# Altium project 0x2a002a.PrjPcb
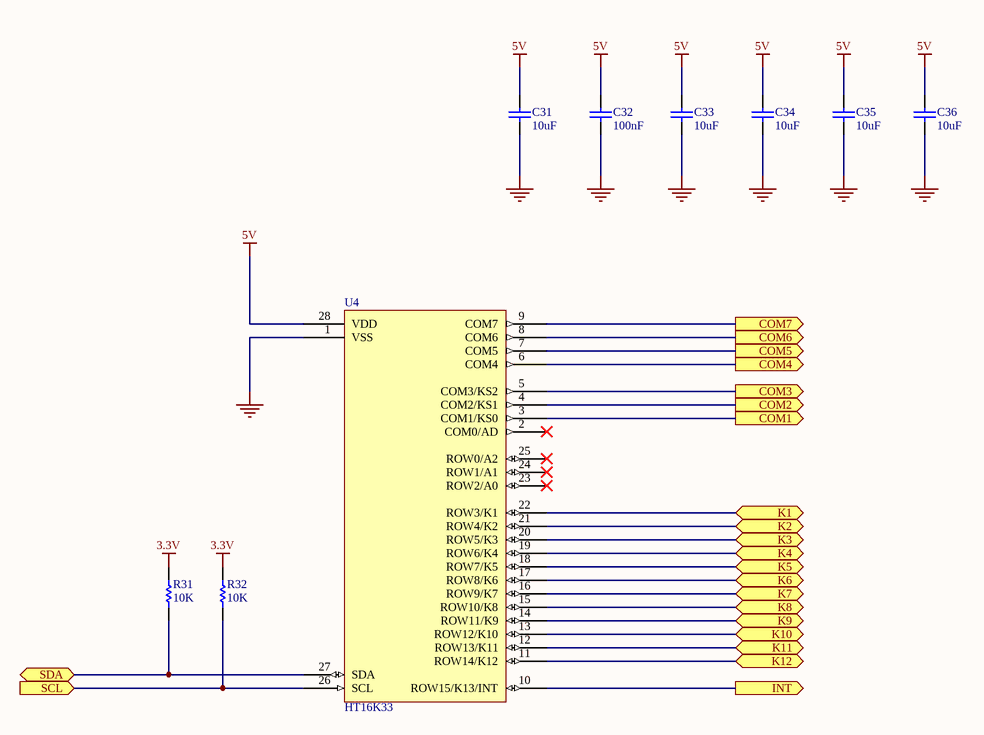
[diagram p0: 3-HT16K33.SchDoc]
3 sheets, 43 parts. Net scope: flat (ports and power ports of the same name join across sheets).
Board file: PCB1.PcbDoc
Sheets:
  3-HT16K33.SchDoc
  4-Memorie.SchDoc
  10-Power.SchDoc

## Sheet 3-HT16K33.SchDoc
size A4

### Parts
C31  10uF  [capa 1206]
C32  100nF  [capa 1206]
C33  10uF  [capa 1206]
C34  10uF  [capa 1206]
C35  10uF  [capa 1206]
C36  10uF  [capa 1206]
R31  10K  [RES 1206]
R32  10K  [RES 1206]
U4  HT16K33  [HT16K33 SOP]

### Ports
COM1 (out), COM2 (out), COM3 (out), COM4 (out), COM5 (out), COM6 (out), COM7 (out), INT (out), K1 (bidir), K2 (bidir), K3 (bidir), K4 (bidir), K5 (bidir), K6 (bidir), K7 (bidir), K8 (bidir), K9 (bidir), K10 (bidir), K11 (bidir), K12 (bidir), SCL (in), SDA (bidir)

### Nets
3.3V: R31.1 R32.2
5V: C31.2 C32.2 C33.2 C34.2 C35.2 C36.2 U4.28(VDD)
GND: C31.1 C32.1 C33.1 C34.1 C35.1 C36.1 U4.1(VSS)
NetR31_2: R31.2 U4.27(SDA) ; port SDA
NetR32_1: R32.1 U4.26(SCL) ; port SCL
NetU4_3: U4.3(COM1/KS0) ; port COM1
NetU4_4: U4.4(COM2/KS1) ; port COM2
NetU4_5: U4.5(COM3/KS2) ; port COM3
NetU4_6: U4.6(COM4) ; port COM4
NetU4_7: U4.7(COM5) ; port COM5
NetU4_8: U4.8(COM6) ; port COM6
NetU4_9: U4.9(COM7) ; port COM7
NetU4_10: U4.10(ROW15/K13/INT) ; port INT
NetU4_11: U4.11(ROW14/K12) ; port K12
NetU4_12: U4.12(ROW13/K11) ; port K11
NetU4_13: U4.13(ROW12/K10) ; port K10
NetU4_14: U4.14(ROW11/K9) ; port K9
NetU4_15: U4.15(ROW10/K8) ; port K8
NetU4_16: U4.16(ROW9/K7) ; port K7
NetU4_17: U4.17(ROW8/K6) ; port K6
NetU4_18: U4.18(ROW7/K5) ; port K5
NetU4_19: U4.19(ROW6/K4) ; port K4
NetU4_20: U4.20(ROW5/K3) ; port K3
NetU4_21: U4.21(ROW4/K2) ; port K2
NetU4_22: U4.22(ROW3/K1) ; port K1

Not connected (* = marked no-connect by the designer): U4 2(COM0/AD)* 23(ROW2/A0)* 24(ROW1/A1)* 25(ROW0/A2)*

### Library data of the parts
C31 C33-C36 = Cap: Capacitor; Fabricant: MULTICOMP; Fournisseur: Farnell; RefFabricant: MC1206X106K160CT; RefFournisseur: 2320922
C32 = Cap: Capacitor; Fabricant: MULTICOMP; Fournisseur: Farnell; RefFabricant: MC1206B104K500CT; RefFournisseur: 1759361
R31 R32 = Res1: Resistor; Fabricant: MULTICOMP; Fournisseur: Farnell; RefFabricant: MC0125W1206510K; RefFournisseur: 9337016
U4 = HT16K33: Fabricant: Holtek; Fournisseur: AliExpress; RefFabricant: HT16K33-28SOP; RefFournisseur: N/A

## Sheet 4-Memorie.SchDoc
size A4
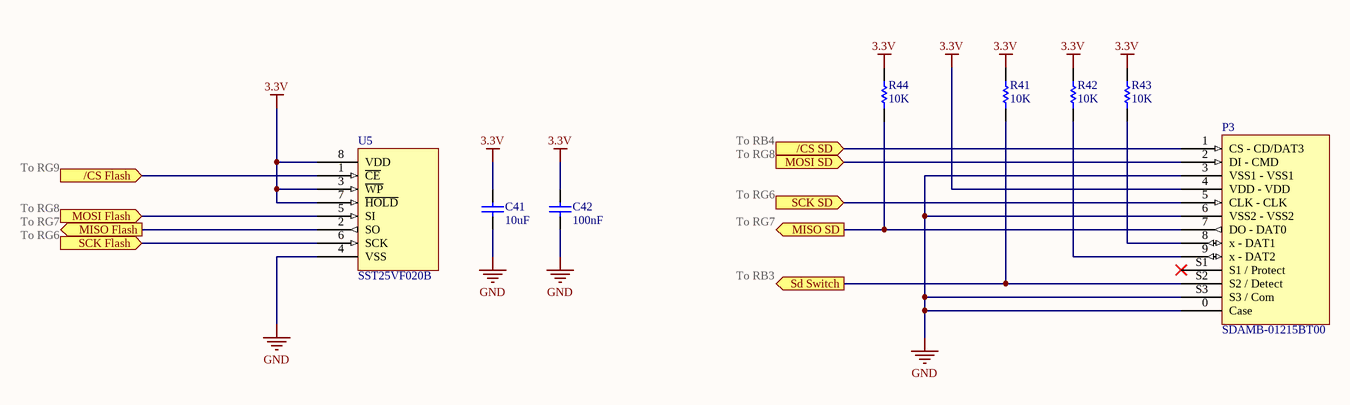
[diagram p1: 4-Memorie.SchDoc]

### Parts
C41  10uF  [capa 1206]
C42  100nF  [capa 1206]
P3  SDAMB-01215BT00
R41  10K  [RES 1206]
R42  10K  [RES 1206]
R43  10K  [RES 1206]
R44  10K  [RES 1206]
U5  SST25VF020B  [SST25VF020B]

### Ports
/CS Flash (in), /CS SD (in), MISO Flash (out), MISO SD (out), MOSI Flash (in), MOSI SD (in), SCK Flash (in), SCK SD (in), Sd Switch (out)

### Nets
3.3V: C41.1 C42.1 P3.4(VDD_-_VDD) R41.2 R42.2 R43.2 R44.2 U5.3(~{WP}) U5.7(~{HOLD}) U5.8(VDD)
GND: C41.2 C42.2 P3.0(Case) P3.3(VSS1_-_VSS1) P3.6(VSS2_-_VSS2) P3.S3(S3_/_Com) U5.4(VSS)
NetP3_1: P3.1(CS_-_CD/DAT3) ; port /CS SD
NetP3_2: P3.2(DI_-_CMD) ; port MOSI SD
NetP3_5: P3.5(CLK_-_CLK) ; port SCK SD
NetP3_7: P3.7(DO_-_DAT0) R44.1 ; port MISO SD
NetP3_8: P3.8(x_-_DAT1) R43.1
NetP3_9: P3.9(x_-_DAT2) R42.1
NetP3_S2: P3.S2(S2_/_Detect) R41.1 ; port Sd Switch
NetU5_1: U5.1(~{CE}) ; port /CS Flash
NetU5_2: U5.2(SO) ; port MISO Flash
NetU5_5: U5.5(SI) ; port MOSI Flash
NetU5_6: U5.6(SCK) ; port SCK Flash

Not connected (* = marked no-connect by the designer): P3 S1(S1_/_Protect)*

### Notes on the sheet
- To RG9
- To RB4
- To RG8
- To RG7
- To RG6
- To RB3

### Library data of the parts
C41 = Cap: as C31 on sheet 3-HT16K33
C42 = Cap: as C32 on sheet 3-HT16K33
P3 = SDAMB-01215BT00: Fabricant: MULTICOMP; Fournisseur: Farnell; RefFournisseur: 9186140; RefFabricant: SDAMB-01215BT00
R41-R44 = Res1: as R31 on sheet 3-HT16K33
U5 = SST25VF020B: Fabricant: MICROCHIP; Fournisseur: Farnell; RefFabricant: SST25VF020B-80-4I-SAE; RefFournisseur: 1829953

## Sheet 10-Power.SchDoc
size A4
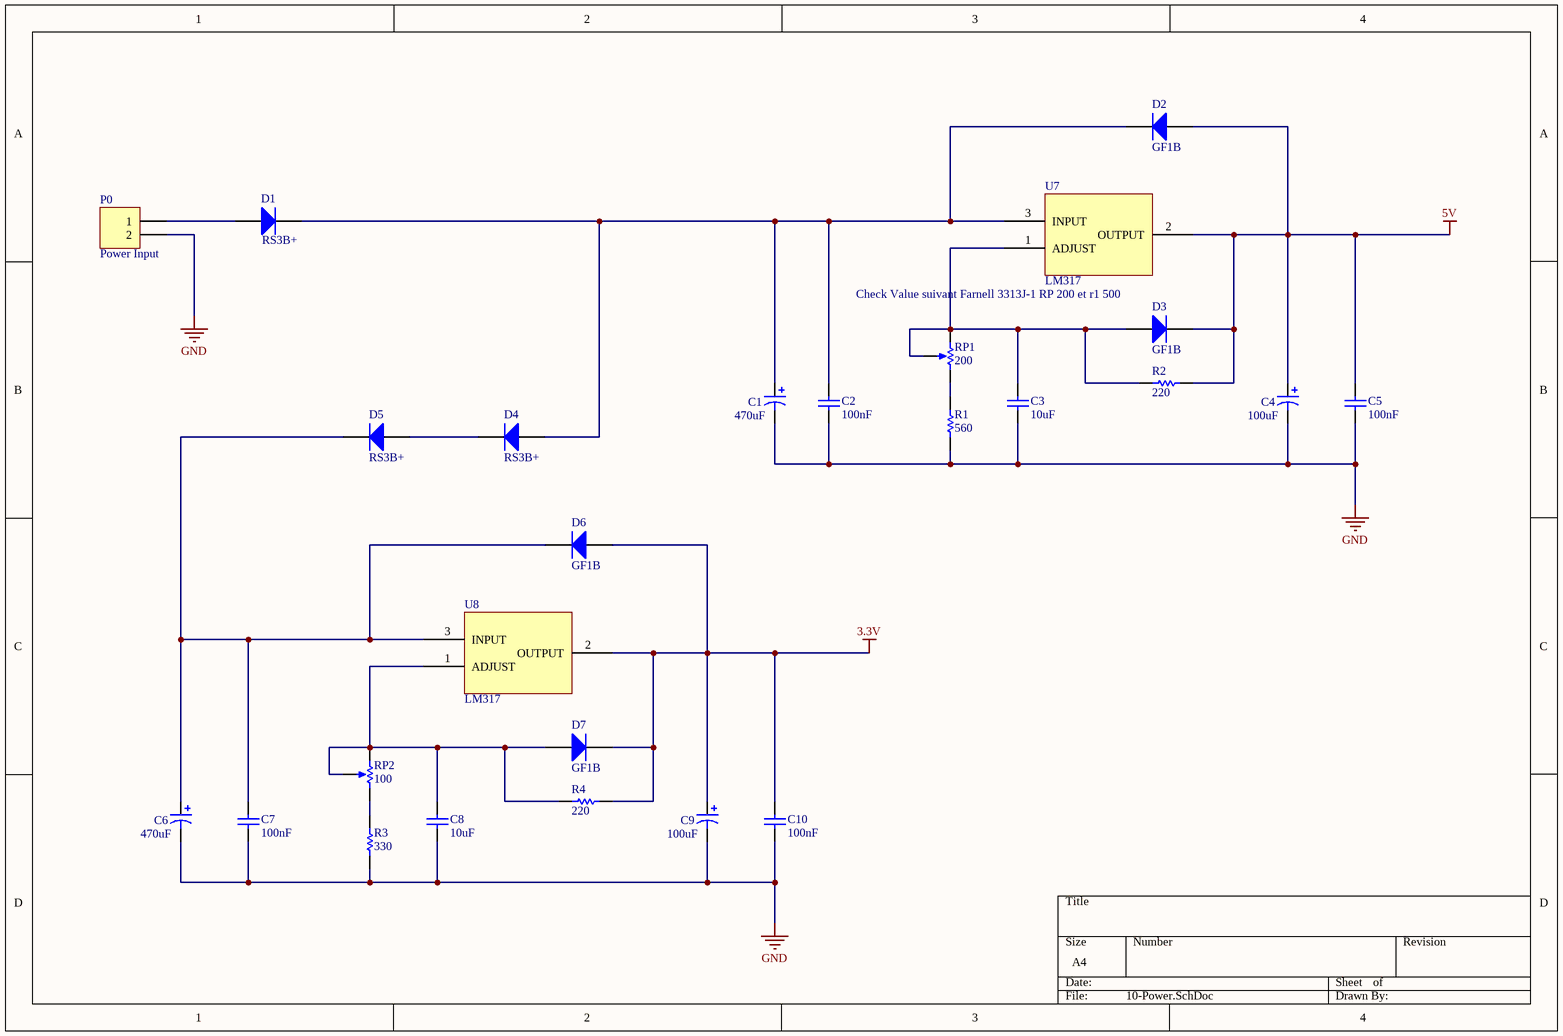
[diagram p2: 10-Power.SchDoc]

### Parts
C1  470uF  [CAPA PANA SIZE D*]
C2  100nF  [capa 1206]
C3  10uF  [capa 1206]
C4  100uF  [CAPA PANA SIZE D*]
C5  100nF  [capa 1206]
C6  470uF  [CAPA PANA SIZE D*]
C7  100nF  [capa 1206]
C8  10uF  [capa 1206]
C9  100uF  [CAPA PANA SIZE D*]
C10  100nF  [capa 1206]
D1  RS3B+  [SMC Vishay]
D2  GF1B  [DO-214AC(SMA)]
D3  GF1B  [DO-214AC(SMA)]
D4  RS3B+  [SMC Vishay]
D5  RS3B+  [SMC Vishay]
D6  GF1B  [DO-214AC(SMA)]
D7  GF1B  [DO-214AC(SMA)]
P0  Power Input  [PWR]
R1  560  [RES 1206]
R2  220  [RES 1206]
R3  330  [RES 1206]
R4  220  [RES 1206]
RP1  200  [3313J-1]
RP2  100  [3313J-1]
U7  LM317  [D2PAK]
U8  LM317  [D2PAK]

### Nets
3.3V: C9.1 C10.2 D6.1(A) D7.2(K) R4.1 U8.2(OUTPUT)
5V: C4.1 C5.2 D2.1(A) D3.2(K) R2.1 U7.2(OUTPUT)
GND: C1.2 C2.1 C3.1 C4.2 C5.1 C6.2 C7.1 C8.1 C9.2 C10.1 P0.2 R1.1 R3.2
NetC1_1: C1.1 C2.2 D1.2(K) D2.2(K) D4.1(A) U7.3(INPUT)
NetC3_2: C3.2 D3.1(A) R2.2 RP1.1(TOP) RP1.3(TAP) U7.1(ADJUST)
NetC6_1: C6.1 C7.2 D5.2(K) D6.2(K) U8.3(INPUT)
NetC8_2: C8.2 D7.1(A) R4.2 RP2.1(TOP) RP2.3(TAP) U8.1(ADJUST)
NetD1_1: D1.1(A) P0.1
NetD4_2: D4.2(K) D5.1(A)
NetR1_2: R1.2 RP1.2(BOT)
NetR3_1: R3.1 RP2.2(BOT)

### Notes on the sheet
- Check Value suivant Farnell 3313J-1 RP 200 et r1 500

### Library data of the parts
C1 C6 = Cap Pol1: Polarized Capacitor (Radial); Fabricant: PANASONIC; Fournisseur: Farnell; RefFabricant: EEEFTA471XAP; RefFournisseur: 2065963
C2 C5 C7 C10 = Cap: as C32 on sheet 3-HT16K33
C3 C8 = Cap: as C31 on sheet 3-HT16K33
C4 C9 = Cap Pol1: Polarized Capacitor (Radial); Fabricant: PANASONIC; Fournisseur: Farnell; RefFabricant: EEE1AA101SP; RefFournisseur: 2326098
D1 D4 D5 = Diode: Default Diode; Fabricant: MULTICOMP; Fournisseur: Farnell; RefFournisseur: 2675034RL; RefFabricant: RS3B+
D2 D3 D6 D7 = Diode: Default Diode; Fabricant: FAIRCHILD SEMICONDUCTOR; Fournisseur: Farnell; RefFournisseur: 1467477; RefFabricant: GF1B
P0 = Header 2: Header, 2-Pin; Fabricant: N/A; Fournisseur: N/A; RefFabricant: N/A; RefFournisseur: N/A
R1 = Res1: Resistor; Fabricant: MULTICOMP; Fournisseur: Farnell; RefFabricant: MC0125W12065560R; RefFournisseur: 9337490
R2 R4 = Res1: Resistor; Fabricant: MULTICOMP; Fournisseur: Farnell; RefFabricant: MC0125W12065220R; RefFournisseur: 9337210
R3 = Res1: Resistor; Fabricant: MULTICOMP; Fournisseur: Farnell; RefFabricant: MC0125W12065330R; RefFournisseur: 9337326
RP1 = RPot: Potentiometer; Fabricant: BOURNS; Fournisseur: Farnell; RefFabricant: 3313J-1-201E; RefFournisseur: 2336460
RP2 = RPot: Potentiometer; Fabricant: BOURNS; Fournisseur: Farnell; RefFabricant: 3313J-1-101E; RefFournisseur: 2321829
U7 U8 = LM317: Fabricant: ON SEMICONDUCTOR; Fournisseur: Farnell; RefFabricant: LM317D2T-TR; RefFournisseur: 1564300

## Nets that join several sheets
3.3V: 3-HT16K33 (R31.1 R32.2), 4-Memorie (10 pins), 10-Power (6 pins)
5V: 3-HT16K33 (7 pins), 10-Power (6 pins)
GND: 3-HT16K33 (7 pins), 4-Memorie (7 pins), 10-Power (13 pins)